# Altium project ADCS Interface Module 2 REVB.PrjPcb (part 2 of 2)

## Sheet AIM2 - SupMCU REVB.SchDoc: SupMCU
size B; DrawnBy: DJW; DocumentNumber: 11; SheetNumber: 11; SheetTotal: 12
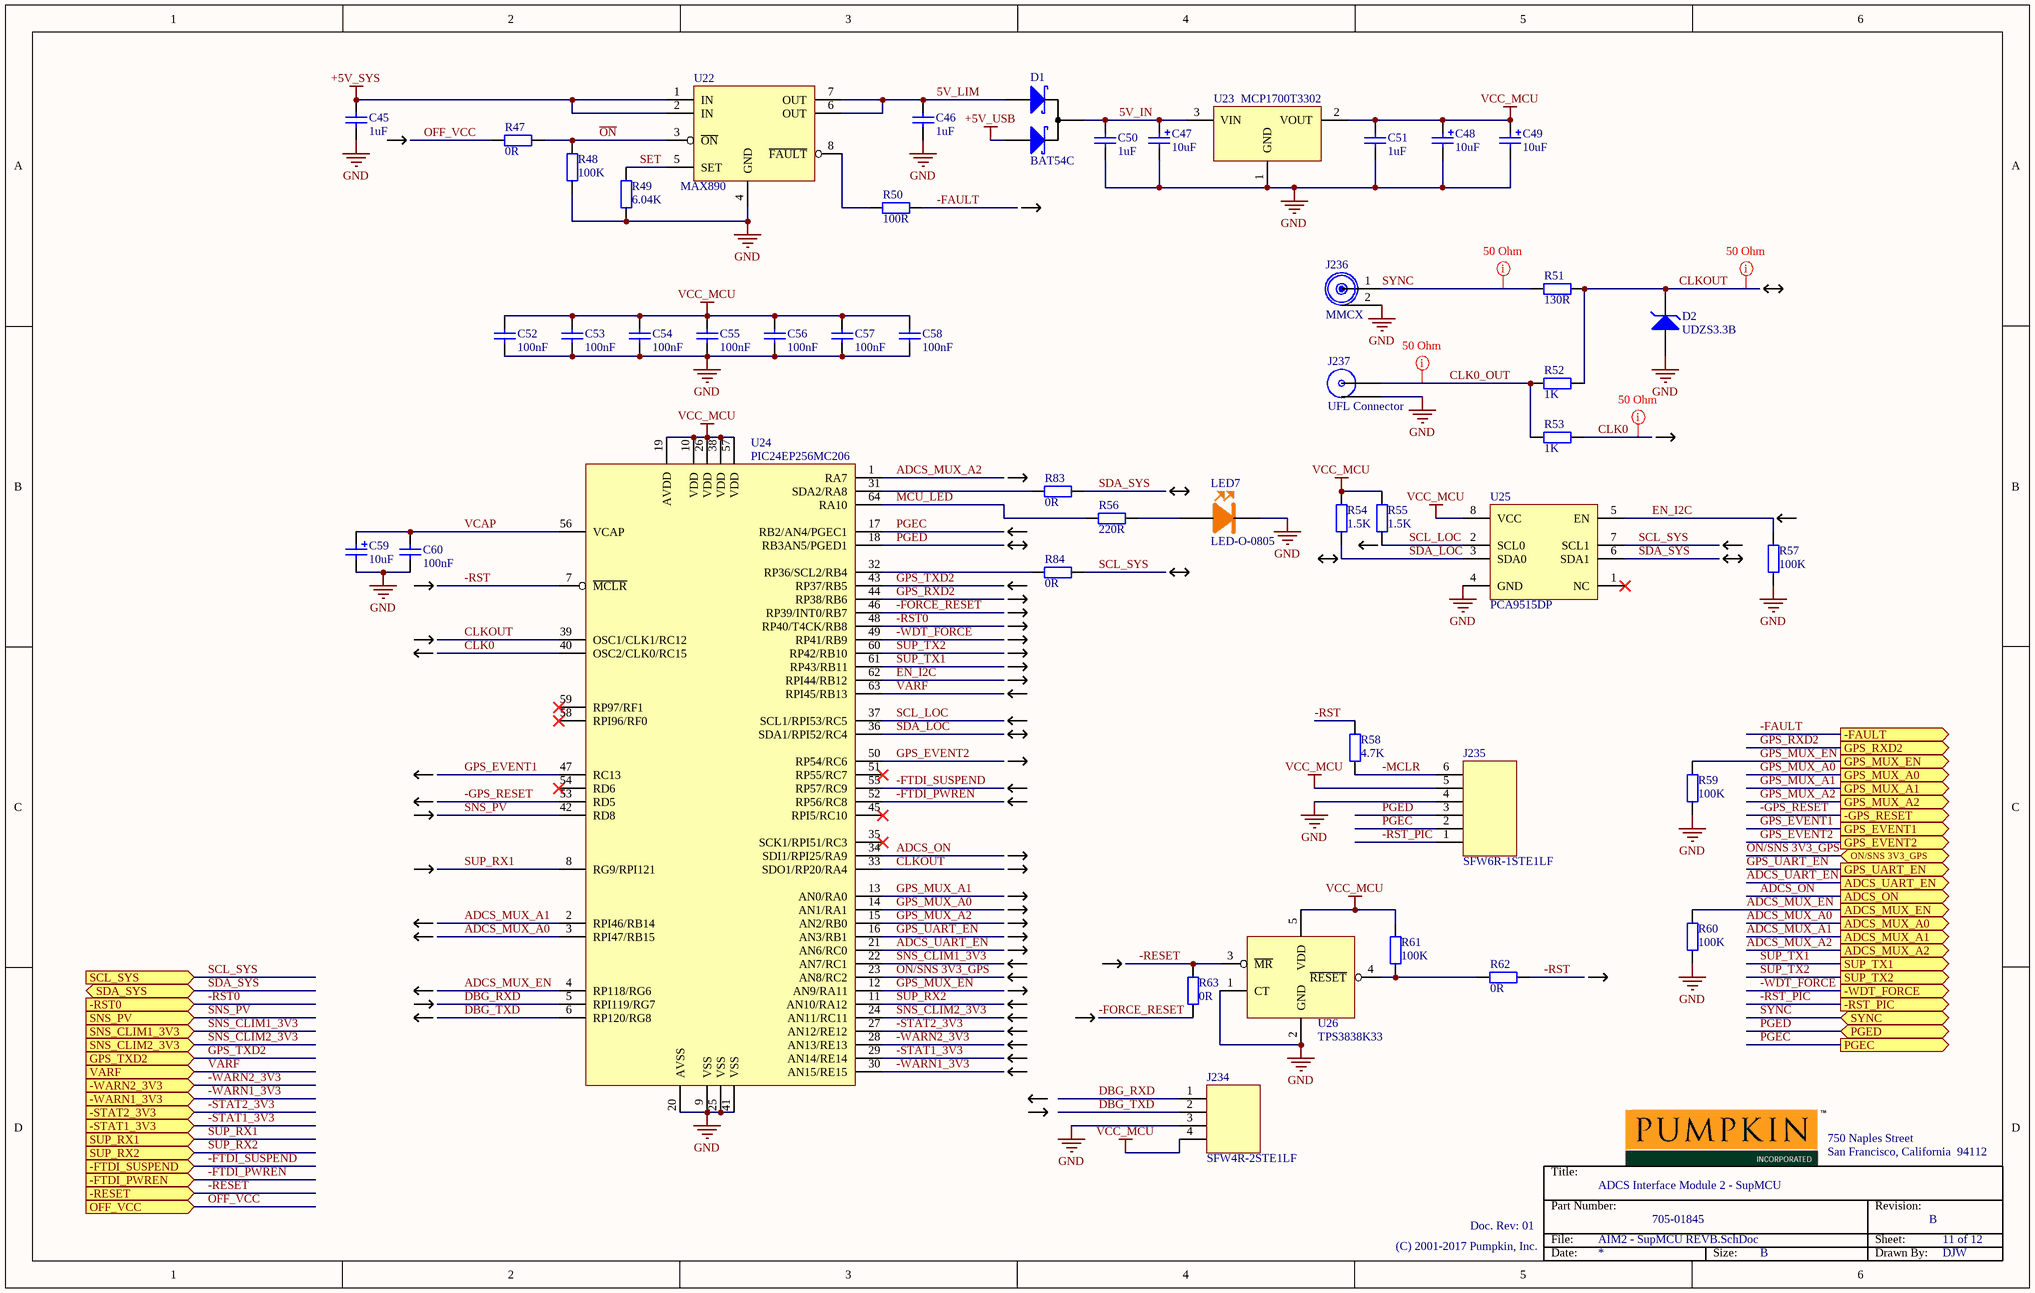
[diagram p10: AIM2 - SupMCU REVB.SchDoc]

### Parts
C45  1uF  [0805 CAP]
C46  1uF  [0805 CAP]
C47  10uF  [6032 POLAR CAP]
C48  10uF  [6032 POLAR CAP]
C49  10uF  [6032 POLAR CAP]
C50  1uF  [0805 CAP]
C51  1uF  [0805 CAP]
C52  100nF  [0603 CAP]
C53  100nF  [0603 CAP]
C54  100nF  [0603 CAP]
C55  100nF  [0603 CAP]
C56  100nF  [0603 CAP]
C57  100nF  [0603 CAP]
C58  100nF  [0603 CAP]
C59  10uF  [6032 POLAR CAP]
C60  100nF  [0603 CAP]
D1  BAT54C  [SOT23-3]
D2  UDZS3.3B  [TSOP190P250X90-2N]
J234  SFW4R-2STE1LF  [SFW4R-2STE1LF]
J235  SFW6R-1STE1LF  [SFW6R-1STE1LF]
J236  MMCX  [mmcx]
J237  UFL Connector  [UFL Connector]
LED7  LED-O-0805  [0805 LED-ORANGE]
R47  0R  [0805 RES]
R48  100K  [0805 RES]
R49  6.04K  [0805 RES]
R50  100R  [0805 RES]
R51  130R  [0805 RES]
R52  1K  [0805 RES - DNP]
R53  1K  [0805 RES]
R54  1.5K  [0805 RES]
R55  1.5K  [0805 RES]
R56  220R  [0805 RES]
R57  100K  [0805 RES]
R58  4.7K  [0805 RES]
R59  100K  [0805 RES]
R60  100K  [0805 RES]
R61  100K  [0805 RES]
R62  0R  [0805 RES]
R63  0R  [0805 RES]
R83  0R  [0805 RES - DNP]  (no BOM)
R84  0R  [0805 RES - DNP]  (no BOM)
U22  MAX890  [SOIC127P600X175-8N]
U23  MCP1700T3302  [SOT23-3]
U24  PIC24EP256MC206  [TSQFP50P1200X1200X120_HS-65N]
U25  PCA9515DP  [TSOP65P490X110-8N]
U26  TPS3838K33  [SOT23-5]

### Ports
-FAULT (out), -FTDI_PWREN (in), -FTDI_SUSPEND (in), -GPS_RESET (out), -RESET (in), -RST0 (in), -RST_PIC (out), -STAT1_3V3 (in), -STAT2_3V3 (in), -WARN1_3V3 (in), -WARN2_3V3 (in), -WDT_FORCE (out), ADCS_MUX_A0 (out), ADCS_MUX_A1 (out), ADCS_MUX_A2 (out), ADCS_MUX_EN (out), ADCS_ON (out), ADCS_UART_EN (out), GPS_EVENT1 (out), GPS_EVENT2 (out), GPS_MUX_A0 (out), GPS_MUX_A1 (out), GPS_MUX_A2 (out), GPS_MUX_EN (out), GPS_RXD2 (out), GPS_TXD2 (in), GPS_UART_EN (out), OFF_VCC (in), ON/SNS 3V3_GPS (bidir), PGEC (out), PGED (bidir), SCL_SYS (in), SDA_SYS (bidir), SNS_CLIM1_3V3 (in), SNS_CLIM2_3V3 (in), SNS_PV (in), SUP_RX1 (in), SUP_RX2 (in), SUP_TX1 (out), SUP_TX2 (out), SYNC (bidir), VARF (in)

### Nets
+5V_SYS: C45.2 U22.1(IN) U22.2(IN)
+5V_USB: D1.2(A)
GND: C45.1 C46.1 C47.2 C48.2 C49.2 C50.1 C51.1 C52.1 C53.1 C54.1 C55.1 C56.1 C57.1 C58.1 C59.2 C60.1 D2.2(A) J234.3 J234.F J235.4 J235.F J236.2 J237.2 LED7.1 R48.1 R49.1 R57.2 R59.1 R60.1 U22.4(GND) U23.1(GND) U24.9(VSS) U24.20(AVSS) U24.25(VSS) U24.41(VSS) U25.4(GND) U26.1(CT) U26.2(GND)
VCC_MCU: C48.1 C49.1 C51.2 C52.2 C53.2 C54.2 C55.2 C56.2 C57.2 C58.2 J234.4 J235.5 R54.2 R55.2 R61.2 U23.2(VOUT) U24.10(VDD) U24.19(AVDD) U24.26(VDD) U24.38(VDD) U24.57(VDD) U25.8(VCC) U26.5(VDD)
5V_IN: C47.1 C50.2 D1.3(K) U23.3(VIN)
5V_LIM: C46.2 D1.1(A) U22.6(OUT) U22.7(OUT)
-FAULT: R50.1 ; port -FAULT
-FORCE_RESET: R63.1 U24.46(RP39/INT0/RB7)
-FTDI_PWREN: U24.52(RP56/RC8) ; port -FTDI_PWREN
-FTDI_SUSPEND: U24.55(RP57/RC9) ; port -FTDI_SUSPEND
-GPS_RESET: U24.53(RD5) ; port -GPS_RESET
-MCLR: J235.6 R58.1
-RESET: R63.2 U26.3(~{MR}) ; port -RESET
-RST: R58.2 R62.2 U24.7(~{MCLR})
-RST0: U24.48(RP40/T4CK/RB8) ; port -RST0
-RST_PIC: J235.1 ; port -RST_PIC
-STAT1_3V3: U24.29(AN14/RE14) ; port -STAT1_3V3
-STAT2_3V3: U24.27(AN12/RE12) ; port -STAT2_3V3
-WARN1_3V3: U24.30(AN15/RE15) ; port -WARN1_3V3
-WARN2_3V3: U24.28(AN13/RE13) ; port -WARN2_3V3
-WDT_FORCE: U24.49(RP41/RB9) ; port -WDT_FORCE
ADCS_MUX_A0: U24.3(RPI47/RB15) ; port ADCS_MUX_A0
ADCS_MUX_A1: U24.2(RPI46/RB14) ; port ADCS_MUX_A1
ADCS_MUX_A2: U24.1(RA7) ; port ADCS_MUX_A2
ADCS_MUX_EN: R60.2 U24.4(RP118/RG6) ; port ADCS_MUX_EN
ADCS_ON: U24.34(SDI1/RPI25/RA9) ; port ADCS_ON
ADCS_UART_EN: U24.21(AN6/RC0) ; port ADCS_UART_EN
CLK0: R53.2 U24.40(OSC2/CLK0/RC15)
CLK0_OUT: J237.1 R52.1 R53.1
CLKOUT: D2.1(K) R51.2 R52.2 U24.33(SDO1/RP20/RA4) U24.39(OSC1/CLK1/RC12)
DBG_RXD: J234.1 U24.5(RPI119/RG7)
DBG_TXD: J234.2 U24.6(RP120/RG8)
EN_I2C: R57.1 U24.62(RPI44/RB12) U25.5(EN)
GPS_EVENT1: U24.47(RC13) ; port GPS_EVENT1
GPS_EVENT2: U24.50(RP54/RC6) ; port GPS_EVENT2
GPS_MUX_A0: U24.14(AN1/RA1) ; port GPS_MUX_A0
GPS_MUX_A1: U24.13(AN0/RA0) ; port GPS_MUX_A1
GPS_MUX_A2: U24.15(AN2/RB0) ; port GPS_MUX_A2
GPS_MUX_EN: R59.2 U24.12(AN9/RA11) ; port GPS_MUX_EN
GPS_RXD2: U24.44(RP38/RB6) ; port GPS_RXD2
GPS_TXD2: U24.43(RP37/RB5) ; port GPS_TXD2
GPS_UART_EN: U24.16(AN3/RB1) ; port GPS_UART_EN
MCU_LED: R56.1 U24.64(RA10)
~{ON}: R47.2 R48.2 U22.3(~{ON})
OFF_VCC: R47.1 ; port OFF_VCC
ON/SNS 3V3_GPS: U24.23(AN8/RC2) ; port ON/SNS 3V3_GPS
PGEC: J235.2 U24.17(RB2/AN4/PGEC1) ; port PGEC
PGED: J235.3 U24.18(RB3AN5/PGED1) ; port PGED
SCL_LOC: R55.1 U24.37(SCL1/RPI53/RC5) U25.2(SCL0)
SCL_SYS: R84.2 U25.7(SCL1) ; port SCL_SYS
SDA_LOC: R54.1 U24.36(SDA1/RPI52/RC4) U25.3(SDA0)
SDA_SYS: R83.2 U25.6(SDA1) ; port SDA_SYS
SET: R49.2 U22.5(SET)
SNS_CLIM1_3V3: U24.22(AN7/RC1) ; port SNS_CLIM1_3V3
SNS_CLIM2_3V3: U24.24(AN11/RC11) ; port SNS_CLIM2_3V3
SNS_PV: U24.42(RD8) ; port SNS_PV
SUP_RX1: U24.8(RG9/RPI121) ; port SUP_RX1
SUP_RX2: U24.11(AN10/RA12) ; port SUP_RX2
SUP_TX1: U24.61(RP43/RB11) ; port SUP_TX1
SUP_TX2: U24.60(RP42/RB10) ; port SUP_TX2
SYNC: J236.1 R51.1 ; port SYNC
VARF: U24.63(RPI45/RB13) ; port VARF
VCAP: C59.1 C60.2 U24.56(VCAP)
NetLED7_2: LED7.2 R56.2
NetR50_2: R50.2 U22.8(~{FAULT})
NetR61_1: R61.1 R62.1 U26.4(~{RESET})
NetR83_1: R83.1 U24.31(SDA2/RA8)
NetR84_1: R84.1 U24.32(RP36/SCL2/RB4)

Not connected (* = marked no-connect by the designer): U24 35(SCK1/RPI51/RC3)* 45(RPI5/RC10)* 51(RP55/RC7)* 54(RD6)* 58(RPI96/RF0)* 59(RP97/RF1)*; U25 1(NC)*

### Layout directives
net class 50 Ohm: CLK0, CLK0_OUT, CLKOUT, SYNC

### Notes on the sheet
- Title:
- 750 Naples Street
- San Francisco, California  94112
- Doc. Rev: 01
- File:
- Part Number:
- Revision:
- Sheet:
- (C) 2001-2017 Pumpkin, Inc.
- Date:
- Size:
- B
- Drawn By:

### Library data of the parts
C45 C46 C50 C51 = Capacitor 1uF 0805: Capacitor 1uF 0805 X7R 25V 10%; Value: 1uF; Supplier 1: Digi-Key; Supplier Part Number 1: 445-5687-1-ND
C47-C49 C59 = Tantalum Cap 10uF: Capacitor 10uF 6032 TANT 16V 10%; Value: 10uF; Supplier 1: Digi-Key; Supplier Part Number 1: 399-3732-1-ND
C52-C58 C60 = Capacitor 100nF 0603: Capacitor 100nF 0603 X7R 50V 5%; Value: 100nF; Supplier 1: Digi-Key; Supplier Part Number 1: 399-7844-1-ND
D1 = BAT54C: Diode Pair common cathode; Supplier 1: Digi-Key; Supplier Part Number 1: 497-3786-1-ND
D2 = UDZS3.3B: Diode 3.3V zener; Supplier 1: Digi-Key; Supplier Part Number 1: UDZVTE-173.3BCT-ND
J234 = SFW4R-2STE1LF: Header Flex Connector 4 pin, top side; Supplier 1: Digi-Key; Supplier Part Number 1: 609-1884-1-ND
J235 = SFW6R-1STE1LF: Header Flex Connector 6 pin, bottom side; Supplier 1: Digi-Key; Supplier Part Number 1: 609-1889-1-ND
J236 = MMCX: Header MMCX Through-hole vertical; Supplier 1: Digi-Key; Supplier Part Number 1: WM9481-ND
LED7 = LED ORANGE 0805: Supplier 1: Digi-Key; Supplier Part Number 1: 160-1413-1-ND
R47 R62 R63 R83 R84 = Resistor 0R 0805: Resistor 0R 0805 0.125W; Revision: Altium ETH 11-03.2008; Value: 0R; Supplier 1: Digi-Key; Supplier Part Number 1: P0.0ACT-ND
R48 R57 R59-R61 = Resistor 100K 0805: Resistor 100K 0805 0.5W 1%; Revision: Altium ETH 11-03.2008; Value: 100K; Supplier 1: Digi-Key; Supplier Part Number 1: P16060CT-ND
R49 = Resistor 6K04 0805: Resistor 6.04K 0805 0.125W 0.1%; Revision: Altium ETH 11-03.2008; Value: 6.04K; Supplier 1: Digi-Key; Supplier Part Number 1: P6.04KDACT-ND
R50 = Resistor 100R 0805: Resistor 100R 0805 0.125W 1%; Revision: Altium ETH 11-03.2008; Value: 100R; Supplier 1: Digi-Key; Supplier Part Number 1: P100CCT-ND
R51 = Resistor 130R 0805: Resistor 130R 0805 0.125W 1%; Revision: Altium ETH 11-03.2008; Value: 130R; Supplier 1: Digi-Key; Supplier Part Number 1: 311-130CRCT-ND
R52 R53 = Resistor 1K 0805: Resistor 1K 0805 0.125W 1%; Revision: Altium ETH 11-03.2008; Value: 1K; Supplier 1: Digi-Key; Supplier Part Number 1: P1.00KCCT-ND
R54 R55 = Resistor 1.5K 0805: Resistor 1.5K 0805 0.125W 1%; Revision: Altium ETH 11-03.2008; Value: 1.5K; Supplier 1: Digi-Key; Supplier Part Number 1: P1.50KCCT-ND
R56 = Resistor 220R 0805: Resistor 220R 0805 0.125W 1%; Revision: Altium ETH 11-03.2008; Value: 220R; Supplier 1: Digi-Key; Supplier Part Number 1: P220CCT-ND
R58 = Resistor 4K7 0805: Resistor 4.7K 0805 0.125W 1%; Revision: Altium ETH 11-03.2008; Value: 4.7K; Supplier 1: Digi-Key; Supplier Part Number 1: 311-4.70KCRCT-ND
U22 = MAX890LESA: IC Power Monitor; Supplier 1: Digi-Key; Supplier Part Number 1: MAX890LESA+-ND
U23 = MCP1700T3302: Regulator 3.3V LDO; Supplier 1: Digi-Key; Supplier Part Number 1: MCP1700T3302ETTCT-ND
U24 = PIC24EP256MC206: IC Processor 16 bit; Supplier 1: Digi-Key; Supplier Part Number 1: PIC24EP256MC206-I/PT-ND
U25 = PCA9515DP: IC Translator I2C; Supplier 1: Digi-Key; Supplier Part Number 1: 568-1034-1-ND
U26 = TPS3838K33DBVR: IC Supervisor Reset; Supplier 1: Digi-Key; Supplier Part Number 1: 296-26956-1-ND
J237 = UFL Connector: Supplier 1: Digi-Key; Supplier Part Number 1: H11891CT-ND

## Sheet AIM2 - MOD REVB.SchDoc: Modification Information
size B; DrawnBy: DJW; DocumentNumber: 10; SheetNumber: 10; SheetTotal: 12
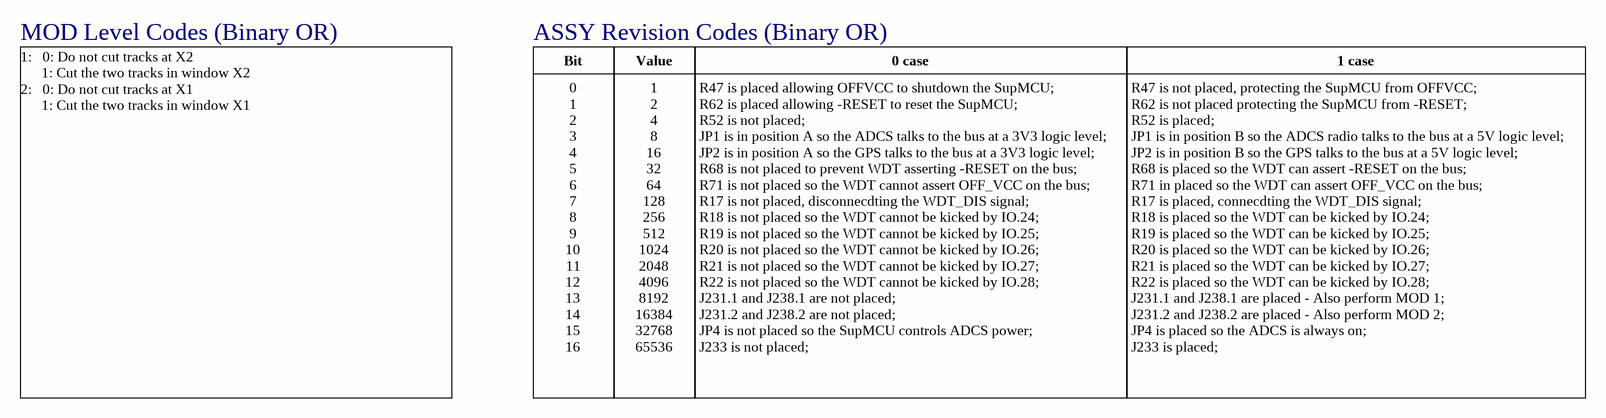
[diagram p11: AIM2 - MOD REVB.SchDoc]

### Notes on the sheet
- MOD Level Codes (Binary OR)
- ASSY Revision Codes (Binary OR)
- Bit
- Value
- 0 case
- 1 case
- 1:   0: Do not cut tracks at X2
  1: Cut the two tracks in window X2
  2:   0: Do not cut tracks at X1
  1: Cut the two tracks in window X1
- 0
  1
  2
  3
  4
  5
  6
  7
  8
  9
  10
  11
  12
  13
  14
  15
  16
- 1
  2
  4
  8
  16
  32
  64
  128
  256
  512
  1024
  2048
  4096
  8192
  16384
  32768
  65536
- R47 is placed allowing OFFVCC to shutdown the SupMCU;
  R62 is placed allowing -RESET to reset the SupMCU;
  R52 is not placed;
  JP1 is in position A so the ADCS talks to the bus at a 3V3 logic level;
  JP2 is in position A so the GPS talks to the bus at a 3V3 logic level;
  R68 is not placed to prevent WDT asserting -RESET on the bus;
  R71 is not placed so the WDT cannot assert OFF_VCC on the bus;
  R17 is not placed, disconnecdting the WDT_DIS signal;
  R18 is not placed so the WDT cannot be kicked by IO.24;
  R19 is not placed so the WDT cannot be kicked by IO.25;
  R20 is not placed so the WDT cannot be kicked by IO.26;
  R21 is not placed so the WDT cannot be kicked by IO.27;
  R22 is not placed so the WDT cannot be kicked by IO.28;
  J231.1 and J238.1 are not placed;
  J231.2 and J238.2 are not placed;
  JP4 is not placed so the SupMCU controls ADCS power;
  J233 is not placed;
- R47 is not placed, protecting the SupMCU from OFFVCC;
  R62 is not placed protecting the SupMCU from -RESET;
  R52 is placed;
  JP1 is in position B so the ADCS radio talks to the bus at a 5V logic level;
  JP2 is in position B so the GPS talks to the bus at a 5V logic level;
  R68 is placed so the WDT can assert -RESET on the bus;
  R71 in placed so the WDT can assert OFF_VCC on the bus;
  R17 is placed, connecdting the WDT_DIS signal;
  R18 is placed so the WDT can be kicked by IO.24;
  R19 is placed so the WDT can be kicked by IO.25;
  R20 is placed so the WDT can be kicked by IO.26;
  R21 is placed so the WDT can be kicked by IO.27;
  R22 is placed so the WDT can be kicked by IO.28;
  J231.1 and J238.1 are placed - Also perform MOD 1;
  J231.2 and J238.2 are placed - Also perform MOD 2;
  JP4 is placed so the ADCS is always on;
  J233 is placed;
- Title:
- 750 Naples Street
- San Francisco, California  94112
- Doc. Rev: 01
- File:
- Part Number:
- Revision:
- Sheet:
- (C) 2001-2017 Pumpkin, Inc.
- Date:
- Size:
- B
- Drawn By:

## Nets that join several sheets
3V3_ADCS_USB: AIM2 - FTDI REVB (21 pins), AIM2 - UART LEDS REVB (C63.2 R79.2 U33.10 U33.16)
+3.3V_ADCS: AIM2 - ADCS REVB (H10.4), AIM2 - Bus Interface REVB (H2.50), AIM2 - External Interfaces REVB (H4.1 H5.1 H5.2)
+5V_ADCS_USB: AIM2 - ADCS REVB (8 pins), AIM2 - FTDI REVB (5 pins)
+5V_SYS: AIM2 - WDT REVB (5 pins), AIM2 - ADCS REVB (C1.2 R1.2 U1.7 U1.8), AIM2 - ADCS Multiplexing REVB (C12.2 JP1.3 U5.1), AIM2 - Bus Interface REVB (H2.25 H2.26), AIM2 - External Interfaces REVB (H8.1 H8.2), AIM2 - GPS Multiplexing REVB (C44.2 JP2.3 U19.1), AIM2 - SupMCU REVB (C45.2 U22.1 U22.2)
+5V_USB: AIM2 - Bus Interface REVB (H1.32), AIM2 - External Interfaces REVB (H8.3 H8.4), AIM2 - GPS REVB (C34.2 C35.2 L3.1 U14.3), AIM2 - SupMCU REVB (D1.2)
GND: AIM2 - WDT REVB (19 pins), AIM2 - ADCS REVB (35 pins), AIM2 - FTDI REVB (42 pins), AIM2 - UART LEDS REVB (6 pins), AIM2 - ADCS Multiplexing REVB (10 pins), AIM2 - Bus Interface REVB (H2.29 H2.30 H2.32 TP100.1), AIM2 - External Interfaces REVB (11 pins), AIM2 - GPS REVB (38 pins), AIM2 - GPS Multiplexing REVB (10 pins), AIM2 - SupMCU REVB (38 pins)
VCC_MCU: AIM2 - WDT REVB (10 pins), AIM2 - ADCS REVB (C6.2 R11.2 U4.5), AIM2 - ADCS Multiplexing REVB (JP1.1), AIM2 - GPS REVB (R39.2 R40.2 R41.2 R42.2), AIM2 - GPS Multiplexing REVB (JP2.1), AIM2 - SupMCU REVB (23 pins)
VCC_SYS: AIM2 - FTDI REVB (C70.2 C71.2), AIM2 - Bus Interface REVB (H2.27 H2.28), AIM2 - External Interfaces REVB (J233.1 J233.6), AIM2 - GPS REVB (6 pins)
-FAULT: AIM2 - Bus Interface REVB (H1.25), AIM2 - SupMCU REVB (R50.1)
-FTDI_PWREN: AIM2 - FTDI REVB (R30.1 U10.60), AIM2 - UART LEDS REVB (R79.1 U33.13), AIM2 - SupMCU REVB (U24.52)
-FTDI_SUSPEND: AIM2 - FTDI REVB (U10.36), AIM2 - SupMCU REVB (U24.55)
-GPS_RESET: AIM2 - GPS REVB (U12.5), AIM2 - SupMCU REVB (U24.53)
-RESET: AIM2 - WDT REVB (R68.2), AIM2 - ADCS REVB (U4.3), AIM2 - Bus Interface REVB (H1.29), AIM2 - External Interfaces REVB (H8.8), AIM2 - SupMCU REVB (R63.2 U26.3)
-RST0: AIM2 - ADCS REVB (H10.10 R12.2), AIM2 - FTDI REVB (R82.1 U10.14), AIM2 - SupMCU REVB (U24.48)
-RST_PIC: AIM2 - WDT REVB (R75.2), AIM2 - SupMCU REVB (J235.1)
-SS0: AIM2 - ADCS REVB (H11.19), AIM2 - Bus Interface REVB (H1.52), AIM2 - External Interfaces REVB (H5.3)
-STAT1_3V3: AIM2 - GPS REVB (R39.1 U17.14), AIM2 - SupMCU REVB (U24.29)
-STAT2_3V3: AIM2 - GPS REVB (R40.1 U17.11), AIM2 - SupMCU REVB (U24.27)
-WARN1_3V3: AIM2 - GPS REVB (R41.1 U17.13), AIM2 - SupMCU REVB (U24.30)
-WARN2_3V3: AIM2 - GPS REVB (R42.1 U17.12), AIM2 - SupMCU REVB (U24.28)
-WDT_FORCE: AIM2 - WDT REVB (U29.2), AIM2 - SupMCU REVB (U24.49)
AD0: AIM2 - ADCS REVB (H10.18), AIM2 - External Interfaces REVB (H4.8)
AD1: AIM2 - ADCS REVB (H10.20), AIM2 - External Interfaces REVB (H4.7)
AD2: AIM2 - ADCS REVB (H10.22), AIM2 - External Interfaces REVB (H4.10)
AD3: AIM2 - ADCS REVB (H10.24), AIM2 - External Interfaces REVB (H4.9)
AD4: AIM2 - ADCS REVB (H10.14), AIM2 - External Interfaces REVB (H4.6)
AD5: AIM2 - ADCS REVB (H10.16), AIM2 - External Interfaces REVB (H4.5)
ADCS_MUX_A0: AIM2 - ADCS Multiplexing REVB (U5.17), AIM2 - SupMCU REVB (U24.3)
ADCS_MUX_A1: AIM2 - ADCS Multiplexing REVB (U5.16), AIM2 - SupMCU REVB (U24.2)
ADCS_MUX_A2: AIM2 - ADCS Multiplexing REVB (U5.15), AIM2 - SupMCU REVB (U24.1)
ADCS_MUX_EN: AIM2 - ADCS Multiplexing REVB (U5.18), AIM2 - SupMCU REVB (R60.2 U24.4)
ADCS_ON: AIM2 - ADCS REVB (R5.1 R10.2), AIM2 - SupMCU REVB (U24.34)
ADCS_RX: AIM2 - ADCS REVB (U3.3), AIM2 - ADCS Multiplexing REVB (U7.4), AIM2 - External Interfaces REVB (R23.2)
ADCS_TX: AIM2 - ADCS REVB (U3.7), AIM2 - ADCS Multiplexing REVB (U6.4), AIM2 - External Interfaces REVB (R24.1)
ADCS_UART_EN: AIM2 - ADCS Multiplexing REVB (C8.2 C10.2 U6.6 U7.6), AIM2 - SupMCU REVB (U24.21)
CLEAR0: AIM2 - ADCS REVB (H11.20), AIM2 - Bus Interface REVB (H1.51), AIM2 - External Interfaces REVB (H5.4)
DRDY0: AIM2 - ADCS REVB (H11.21), AIM2 - Bus Interface REVB (H1.50), AIM2 - External Interfaces REVB (H5.5)
EECLK: AIM2 - FTDI REVB (R27.1 U10.62 U11.4), AIM2 - UART LEDS REVB (U33.11)
EECS: AIM2 - FTDI REVB (R26.1 U10.63 U11.5), AIM2 - UART LEDS REVB (U33.12)
EEDATA: AIM2 - FTDI REVB (R29.2 U10.61 U11.3), AIM2 - UART LEDS REVB (U33.14)
GPS_EVENT1: AIM2 - GPS REVB (U12.9), AIM2 - SupMCU REVB (U24.47)
GPS_EVENT2: AIM2 - GPS REVB (U12.7), AIM2 - SupMCU REVB (U24.50)
GPS_MUX_A0: AIM2 - GPS Multiplexing REVB (U19.17), AIM2 - SupMCU REVB (U24.14)
GPS_MUX_A1: AIM2 - GPS Multiplexing REVB (U19.16), AIM2 - SupMCU REVB (U24.13)
GPS_MUX_A2: AIM2 - GPS Multiplexing REVB (U19.15), AIM2 - SupMCU REVB (U24.15)
GPS_MUX_EN: AIM2 - GPS Multiplexing REVB (U19.18), AIM2 - SupMCU REVB (R59.2 U24.12)
GPS_RXD2: AIM2 - GPS REVB (U12.15), AIM2 - SupMCU REVB (U24.44)
GPS_TXD2: AIM2 - GPS REVB (U12.14), AIM2 - SupMCU REVB (U24.43)
GPS_UART_EN: AIM2 - GPS Multiplexing REVB (C40.2 C42.2 U20.6 U21.6), AIM2 - SupMCU REVB (U24.16)
IO.30: AIM2 - ADCS REVB (R3.1), AIM2 - Bus Interface REVB (H2.18)
MISO0: AIM2 - ADCS REVB (H11.24), AIM2 - Bus Interface REVB (H2.49), AIM2 - External Interfaces REVB (H5.8)
MOSI0: AIM2 - ADCS REVB (H11.23), AIM2 - Bus Interface REVB (H1.48), AIM2 - External Interfaces REVB (H5.7)
NetU12_11: AIM2 - GPS REVB (U12.11), AIM2 - GPS Multiplexing REVB (U20.4)
NetU12_12: AIM2 - GPS REVB (U12.12), AIM2 - GPS Multiplexing REVB (U21.4)
OFF_VCC: AIM2 - WDT REVB (R71.2), AIM2 - Bus Interface REVB (H1.31), AIM2 - External Interfaces REVB (H8.7), AIM2 - SupMCU REVB (R47.1)
ON/SNS 3V3_GPS: AIM2 - GPS REVB (R43.1 R44.2 U17.3 U17.6), AIM2 - SupMCU REVB (U24.23)
PGEC: AIM2 - WDT REVB (R74.2 U32.3), AIM2 - SupMCU REVB (J235.2 U24.17)
PGED: AIM2 - WDT REVB (R73.1 U32.1), AIM2 - SupMCU REVB (J235.3 U24.18)
PPS: AIM2 - ADCS REVB (R14.1 R15.2 R16.2), AIM2 - Bus Interface REVB (H1.46), AIM2 - GPS REVB (5 pins)
RXD1: AIM2 - ADCS REVB (H11.6), AIM2 - FTDI REVB (U10.48)
RXD2: AIM2 - ADCS REVB (H11.4), AIM2 - FTDI REVB (U10.16)
RXD3: AIM2 - ADCS REVB (H11.2), AIM2 - FTDI REVB (U10.26)
RXD_0: AIM2 - ADCS REVB (U3.1), AIM2 - FTDI REVB (U10.38)
SCL_SYS: AIM2 - Bus Interface REVB (H1.43), AIM2 - External Interfaces REVB (H8.10 J233.7 J233.8), AIM2 - SupMCU REVB (R84.2 U25.7)
SCLK0: AIM2 - ADCS REVB (H11.22), AIM2 - Bus Interface REVB (H1.49), AIM2 - External Interfaces REVB (H5.6)
SDA_SYS: AIM2 - Bus Interface REVB (H1.41), AIM2 - External Interfaces REVB (H8.9 J233.2 J233.4), AIM2 - SupMCU REVB (R83.2 U25.6)
SNS_CLIM1_3V3: AIM2 - GPS REVB (R45.2 U17.4), AIM2 - SupMCU REVB (U24.22)
SNS_CLIM2_3V3: AIM2 - GPS REVB (R46.2 U17.5), AIM2 - SupMCU REVB (U24.24)
SNS_PV: AIM2 - GPS REVB (R33.1 U12.17), AIM2 - SupMCU REVB (U24.42)
SUP_RX1: AIM2 - ADCS Multiplexing REVB (U5.25), AIM2 - GPS Multiplexing REVB (U19.20), AIM2 - SupMCU REVB (U24.8)
SUP_RX2: AIM2 - ADCS Multiplexing REVB (U5.26), AIM2 - GPS Multiplexing REVB (U19.19), AIM2 - SupMCU REVB (U24.11)
SUP_TX1: AIM2 - ADCS Multiplexing REVB (U5.5), AIM2 - GPS Multiplexing REVB (U19.10), AIM2 - SupMCU REVB (U24.61)
SUP_TX2: AIM2 - ADCS Multiplexing REVB (U5.4), AIM2 - GPS Multiplexing REVB (U19.11), AIM2 - SupMCU REVB (U24.60)
SYNC: AIM2 - Bus Interface REVB (H1.45), AIM2 - SupMCU REVB (J236.1 R51.1)
TXD1: AIM2 - ADCS REVB (H11.5), AIM2 - FTDI REVB (U10.52)
TXD2: AIM2 - ADCS REVB (H11.3), AIM2 - FTDI REVB (U10.17)
TXD3: AIM2 - ADCS REVB (H11.1), AIM2 - FTDI REVB (U10.27)
TXD_0: AIM2 - ADCS REVB (U3.8), AIM2 - FTDI REVB (U10.39)
URX0: AIM2 - ADCS Multiplexing REVB (U5.23), AIM2 - Bus Interface REVB (H1.19), AIM2 - GPS Multiplexing REVB (U19.21)
URX1: AIM2 - ADCS Multiplexing REVB (U5.22), AIM2 - Bus Interface REVB (H1.17), AIM2 - GPS Multiplexing REVB (U19.22)
URX2: AIM2 - ADCS Multiplexing REVB (U5.19), AIM2 - Bus Interface REVB (H1.7), AIM2 - GPS Multiplexing REVB (U19.24)
URX3: AIM2 - ADCS Multiplexing REVB (U5.20), AIM2 - Bus Interface REVB (H2.15), AIM2 - GPS Multiplexing REVB (U19.23)
UTX0: AIM2 - ADCS Multiplexing REVB (U5.7), AIM2 - Bus Interface REVB (H1.20), AIM2 - GPS Multiplexing REVB (U19.9)
UTX1: AIM2 - ADCS Multiplexing REVB (U5.8), AIM2 - Bus Interface REVB (H1.18), AIM2 - GPS Multiplexing REVB (U19.8)
UTX2: AIM2 - ADCS Multiplexing REVB (U5.11), AIM2 - Bus Interface REVB (H1.8), AIM2 - GPS Multiplexing REVB (U19.6)
UTX3: AIM2 - ADCS Multiplexing REVB (U5.10), AIM2 - Bus Interface REVB (H2.16), AIM2 - GPS Multiplexing REVB (U19.7)
VARF: AIM2 - Bus Interface REVB (H2.17), AIM2 - GPS REVB (R34.2), AIM2 - SupMCU REVB (U24.63)
WDT: AIM2 - WDT REVB (R67.2 U29.1), AIM2 - Bus Interface REVB (5 pins)
WDT_DIS: AIM2 - WDT REVB (JP3.2 R65.2 R66.2 U27.1), AIM2 - Bus Interface REVB (R17.1)

## Assembly variants
Placed Components Only: not fitted J231.1 J231.2 J233 J238.1 J238.2 JP4 R17 R18 R19 R20 R21 R22 R52 R68 R71